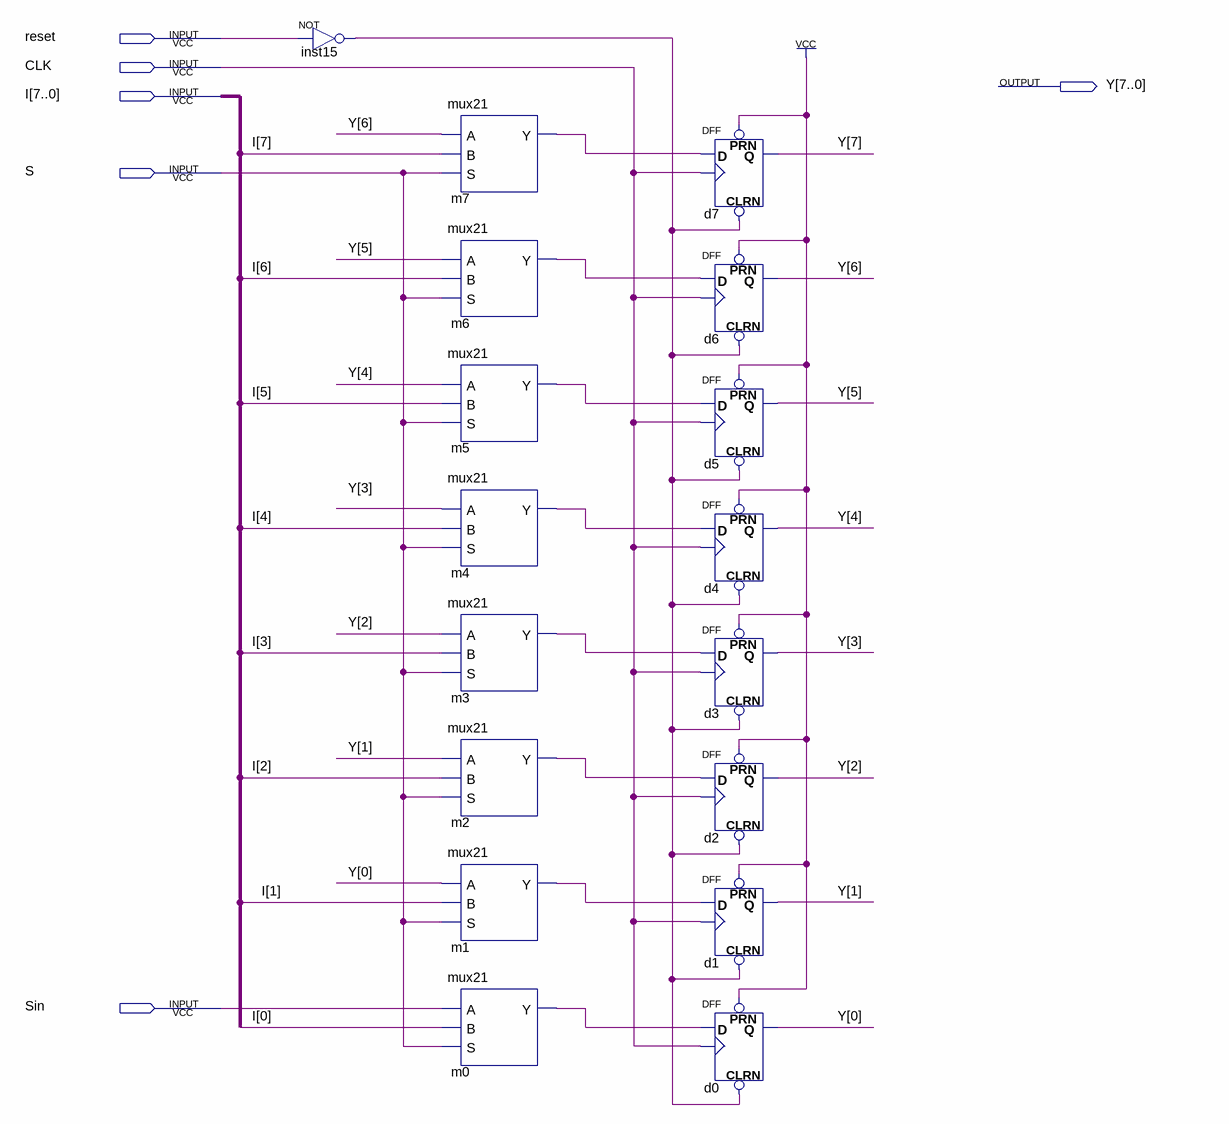
[diagram p0: schematic sheet]
// Quartus schematic o8bit_rshifter_loader.bdf as structural Verilog: 17 symbols, 6 pins
module o8bit_rshifter_loader (
  input  reset,
  input  CLK,
  input  [7:0] I,
  input  S,
  input  Sin,
  output [7:0] Y
);

  wire inst15_out, m0_y, m1_y, m2_y, m3_y, m4_y, m5_y, m6_y, m7_y;

  not inst15 (inst15_out, reset);
  mux21 m7 (.A(Y[6]), .B(I[7]), .S(S), .Y(m7_y));
  mux21 m6 (.A(Y[5]), .B(I[6]), .S(S), .Y(m6_y));
  mux21 m5 (.A(Y[4]), .B(I[5]), .S(S), .Y(m5_y));
  mux21 m4 (.A(Y[3]), .B(I[4]), .S(S), .Y(m4_y));
  mux21 m3 (.A(Y[2]), .B(I[3]), .S(S), .Y(m3_y));
  mux21 m2 (.A(Y[1]), .B(I[2]), .S(S), .Y(m2_y));
  mux21 m1 (.A(Y[0]), .B(I[1]), .S(S), .Y(m1_y));
  mux21 m0 (.A(Sin), .B(I[0]), .S(S), .Y(m0_y));
  DFF d7 (.CLRN(inst15_out), .CLK(CLK), .D(m7_y), .PRN(1'b1), .Q(Y[7]));
  DFF d6 (.CLRN(inst15_out), .CLK(CLK), .D(m6_y), .PRN(1'b1), .Q(Y[6]));
  DFF d5 (.CLRN(inst15_out), .CLK(CLK), .D(m5_y), .PRN(1'b1), .Q(Y[5]));
  DFF d4 (.CLRN(inst15_out), .CLK(CLK), .D(m4_y), .PRN(1'b1), .Q(Y[4]));
  DFF d3 (.CLRN(inst15_out), .CLK(CLK), .D(m3_y), .PRN(1'b1), .Q(Y[3]));
  DFF d2 (.CLRN(inst15_out), .CLK(CLK), .D(m2_y), .PRN(1'b1), .Q(Y[2]));
  DFF d1 (.CLRN(inst15_out), .CLK(CLK), .D(m1_y), .PRN(1'b1), .Q(Y[1]));
  DFF d0 (.CLRN(inst15_out), .CLK(CLK), .D(m0_y), .PRN(1'b1), .Q(Y[0]));
endmodule
